# Altium project F1-chip.PrjPcb
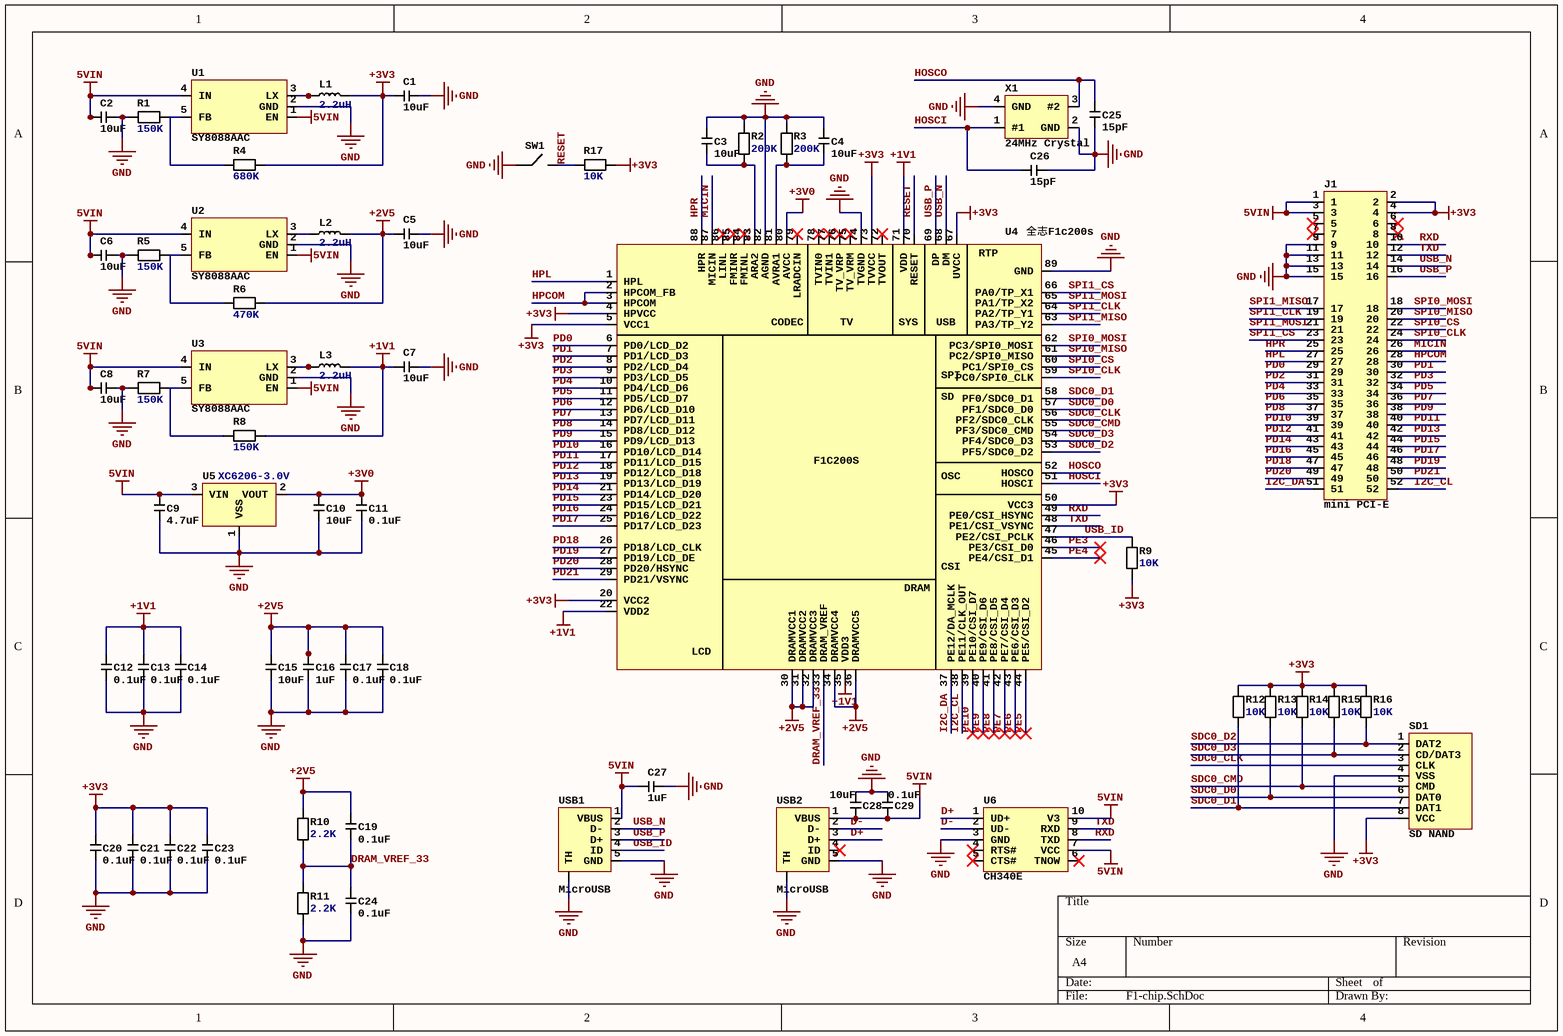
[diagram p0: F1-chip.SchDoc]
1 sheet, 61 parts. Net scope: global (net labels, ports and power ports of the same name join across sheets).
Board file: F1-chip.PcbDoc

## Sheet F1-chip.SchDoc
size A4

### Parts
C1  10uF  [CAP_0402]
C2  10uF  [CAP_0402]
C3  10uF  [CAP_0402]
C4  10uF  [CAP_0402]
C5  10uF  [CAP_0402]
C6  10uF  [CAP_0402]
C7  10uF  [CAP_0402]
C8  10uF  [CAP_0402]
C9  4.7uF  [CAP_0402]
C10  10uF  [CAP_0402]
C11  0.1uF  [CAP_0402]
C12  0.1uF  [CAP_0402]
C13  0.1uF  [CAP_0402]
C14  0.1uF  [CAP_0402]
C15  10uF  [CAP_0402]
C16  1uF  [CAP_0402]
C17  0.1uF  [CAP_0402]
C18  0.1uF  [CAP_0402]
C19  0.1uF  [CAP_0402]
C20  0.1uF  [CAP_0402]
C21  0.1uF  [CAP_0402]
C22  0.1uF  [CAP_0402]
C23  0.1uF  [CAP_0402]
C24  0.1uF  [CAP_0402]
C25  15pF  [CAP_0402]
C26  15pF  [CAP_0402]
C27  1uF  [CAP_0402]
C28  10uF  [CAP_0402]
C29  0.1uF  [CAP_0402]
J1  mini PCI-E  [mini PCI-E]
L1  2.2uH  [IND_0603]
L2  2.2uH  [IND_0603]
L3  2.2uH  [IND_0603]
R1  150K  [RES_0402]
R2  200K  [RES_0402]
R3  200K  [RES_0402]
R4  680K  [RES_0402]
R5  150K  [RES_0402]
R6  470K  [RES_0402]
R7  150K  [RES_0402]
R8  150K  [RES_0402]
R9  10K  [RES_0402]
R10  2.2K  [RES_0402]
R11  2.2K  [RES_0402]
R12  10K  [RES_0402]
R13  10K  [RES_0402]
R14  10K  [RES_0402]
R15  10K  [RES_0402]
R16  10K  [RES_0402]
R17  10K  [RES_0402]
SD1  SD NAND  [SD NAND]
SW1  贴片按钮  [BUTTON2]  (value not drawn)
U1  SY8088AAC  [SY8088AAC]
U2  SY8088AAC  [SY8088AAC]
U3  SY8088AAC  [SY8088AAC]
U4  全志F1c200s  [F1c200s]
U5  XC6206-3.0V  [XC6206]
U6  CH340E  [CH340E]
USB1  MicroUSB  [MicroUSB]
USB2  MicroUSB  [MicroUSB]
X1  24MHz Crystal  [SMD3225]

### Nets
5VIN: C2.1 C6.1 C8.1 C9.2 C27.1 C28.1 C29.1 J1.1 J1.3 U1.1(EN) U1.4(IN) U2.1(EN) U2.4(IN) U3.1(EN) U3.4(IN) U5.3(VIN) U6.7(VCC) U6.10(V3) USB1.1(VBUS) USB2.1(VBUS)
+1V1: C7.1 C12.2 C13.2 C14.2 L3.2 R8.2 U4.22(VDD2) U4.35(VDD3) U4.71(VDD)
+2V5: C5.1 C15.2 C16.2 C17.2 C18.2 C19.2 L2.2 R6.2 R10.2 U4.30(DRAMVCC1) U4.31(DRAMVCC2) U4.32(DRAMVCC3) U4.34(DRAMVCC4) U4.36(DRAMVCC5)
+3V0: C10.2 C11.2 U4.80(AVCC) U5.2(VOUT)
+3V3: C1.1 C20.2 C21.2 C22.2 C23.2 J1.2 J1.4 L1.2 R4.2 R9.1 R12.2 R13.2 R14.2 R15.2 R16.2 R17.2 SD1.8(VCC) U4.4(HPVCC) U4.5(VCC1) U4.20(VCC2) U4.50(VCC3) U4.67(UVCC) U4.73(TVVCC)
GND: C1.2 C2.2 C3.2 C4.2 C5.2 C6.2 C7.2 C8.2 C9.1 C10.1 C11.1 C12.1 C13.1 C14.1 C15.1 C16.1 C17.1 C18.1 C20.1 C21.1 C22.1 C23.1 C24.1 C25.1 C26.2 C27.2 C28.2 C29.2 J1.9 J1.11 J1.13 J1.15 R1.1 R2.2 R3.2 R5.1 R7.1 R11.1 SD1.4(VSS) SW1.1 U1.2(GND) U2.2(GND) U3.2(GND) U4.74(TVGND) U4.82(AGND) U4.89(GND) U5.1(VSS) U6.3(GND) USB1.0(TH) USB1.5(GND) USB2.0(TH) USB2.5(GND) X1.2(GND) X1.4(GND)
D+: U6.1(UD+) USB2.3(D+)
D-: U6.2(UD-) USB2.2(D-)
DRAM_VREF_33: C19.1 C24.2 R10.1 R11.2 U4.33(DRAM_VREF)
HOSCI: C26.1 U4.51(HOSCI) X1.1(#1)
HOSCO: C25.2 U4.52(HOSCO) X1.3(#2)
HPCOM: J1.28 U4.2(HPCOM_FB) U4.3(HPCOM)
HPL: J1.27 U4.1(HPL)
HPR: J1.25 U4.88(HPR)
I2C_CL: J1.52 U4.38(PE11/CLK_OUT)
I2C_DA: J1.51 U4.37(PE12/DA_MCLK)
MICIN: J1.26 U4.87(MICIN)
PD0: J1.29 U4.6(PD0/LCD_D2)
PD1: J1.30 U4.7(PD1/LCD_D3)
PD2: J1.31 U4.8(PD2/LCD_D4)
PD3: J1.32 U4.9(PD3/LCD_D5)
PD4: J1.33 U4.10(PD4/LCD_D6)
PD5: J1.34 U4.11(PD5/LCD_D7)
PD6: J1.35 U4.12(PD6/LCD_D10)
PD7: J1.36 U4.13(PD7/LCD_D11)
PD8: J1.37 U4.14(PD8/LCD_D12)
PD9: J1.38 U4.15(PD9/LCD_D13)
PD10: J1.39 U4.16(PD10/LCD_D14)
PD11: J1.40 U4.17(PD11/LCD_D15)
PD12: J1.41 U4.18(PD12/LCD_D18)
PD13: J1.42 U4.19(PD13/LCD_D19)
PD14: J1.43 U4.21(PD14/LCD_D20)
PD15: J1.44 U4.23(PD15/LCD_D21)
PD16: J1.45 U4.24(PD16/LCD_D22)
PD17: J1.46 U4.25(PD17/LCD_D23)
PD18: J1.47 U4.26(PD18/LCD_CLK)
PD19: J1.48 U4.27(PD19/LCD_DE)
PD20: J1.49 U4.28(PD20/HSYNC)
PD21: J1.50 U4.29(PD21/VSYNC)
PE3: U4.46(PE3/CSI_D0)
PE4: U4.45(PE4/CSI_D1)
PE5: U4.44(PE5/CSI_D2)
PE6: U4.43(PE6/CSI_D3)
PE7: U4.42(PE7/CSI_D4)
PE8: U4.41(PE8/CSI_D5)
PE9: U4.40(PE9/CSI_D6)
PE10: U4.39(PE10/CSI_D7)
RESET: R17.1 SW1.2 U4.70(RESET)
RXD: J1.10 U4.49(PE0/CSI_HSYNC) U6.8(TXD)
SDC0_CLK: SD1.3(CLK) U4.56(PF2/SDC0_CLK)
SDC0_CMD: R14.1 SD1.5(CMD) U4.55(PF3/SDC0_CMD)
SDC0_D0: R13.1 SD1.6(DAT0) U4.57(PF1/SDC0_D0)
SDC0_D1: R12.1 SD1.7(DAT1) U4.58(PF0/SDC0_D1)
SDC0_D2: R16.1 SD1.1(DAT2) U4.53(PF5/SDC0_D2)
SDC0_D3: R15.1 SD1.2(CD/DAT3) U4.54(PF4/SDC0_D3)
SPI0_CLK: J1.24 U4.59(PC0/SPI0_CLK)
SPI0_CS: J1.22 U4.60(PC1/SPI0_CS)
SPI0_MISO: J1.20 U4.61(PC2/SPI0_MISO)
SPI0_MOSI: J1.18 U4.62(PC3/SPI0_MOSI)
SPI1_CLK: J1.19 U4.64(PA2/TP_Y1)
SPI1_CS: J1.23 U4.66(PA0/TP_X1)
SPI1_MISO: J1.17 U4.63(PA3/TP_Y2)
SPI1_MOSI: J1.21 U4.65(PA1/TP_X2)
TXD: J1.12 U4.48(PE1/CSI_VSYNC) U6.9(RXD)
USB_ID: R9.2 U4.47(PE2/CSI_PCLK) USB1.4(ID)
USB_N: J1.14 U4.68(DM) USB1.2(D-)
USB_P: J1.16 U4.69(DP) USB1.3(D+)
NetC3_1: C3.1 R2.1 U4.83(ARA2)
NetC4_1: C4.1 R3.1 U4.81(AVRA1)
NetL1_1: L1.1 U1.3(LX)
NetL2_1: L2.1 U2.3(LX)
NetL3_1: L3.1 U3.3(LX)
NetR1_2: R1.2 R4.1 U1.5(FB)
NetR5_2: R5.2 R6.1 U2.5(FB)
NetR7_2: R7.2 R8.1 U3.5(FB)

Not connected (* = marked no-connect by the designer): J1 5* 6* 7* 8*; U4 72(TVOUT)* 75(TV_VRM)* 76(TV_VRP)* 77(TVIN1)* 78(TVIN0)* 79(LRADCIN)* 84(FMINL)* 85(FMINR)* 86(LINL)*; U6 4(RTS#)* 5(CTS#)* 6(TNOW)*; USB2 4(ID)*

### Notes on the sheet
- (in symbol F1c200s) RTP; CODEC; TV; SYS; USB; SPI; SD; F1C200S; OSC; CSI; DRAM; LCD

### Library data of the parts
C1-C8 C10 C15 C28 = CAP_0402_10uF: 0402
C9 = CAP_0402_4.7uF: 0402
C11-C14 C17-C24 C29 = CAP_0402_0.1uF: 0402
C16 C27 = CAP_0402_1uF: 0402
C25 C26 = CAP_0402_15pF: 0402
L1-L3 = IND_0603_2.2uH: 0603
R1 R5 R7 R8 = RES_0402_150K: 0402
R2 R3 = RES_0402_200K: 0402
R4 = RES_0402_680K: 0402
R6 = RES_0402_470K: 0402
R9 R12-R17 = RES_0402_10K: 0402
R10 R11 = RES_0402_2.2K: 0402
SW1 = 贴片按钮: 3*4*2两脚小龟贴片按钮
U1-U3 = SY8088AAC: SOT23-5
U4 = F1c200s: MQFN-88
U5 = XC6206-3.0V: SOT23-3
U6 = CH340E: MSOP-10
X1 = 24MHz Crystal: SMD3225